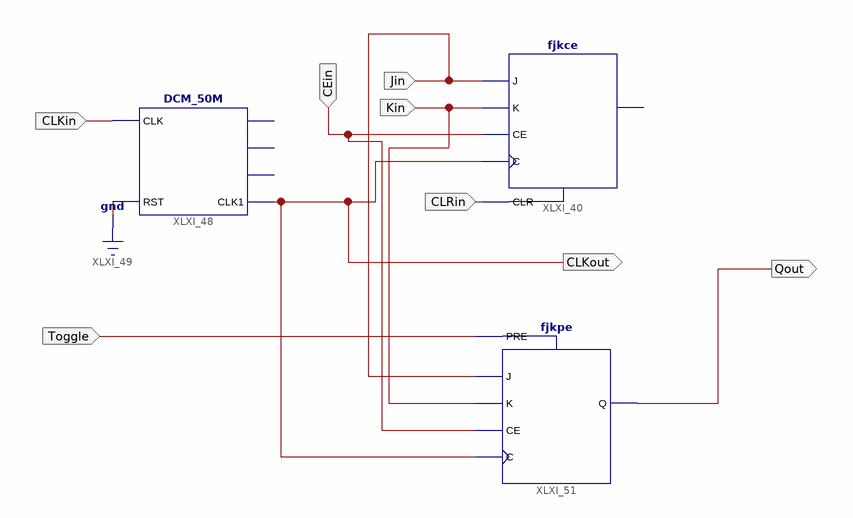
[diagram p0: schematic sheet 1]
// Xilinx ISE schematic lab7_experiment9.sch (spartan3e) as structural Verilog: 3 symbols, 8 ports
module lab7_experiment9 (
  input  Jin,
  input  Kin,
  input  CEin,
  input  CLRin,
  input  CLKin,
  input  Toggle,
  output CLKout,
  output Qout
);

  fjkce XLXI_40 (.C(CLKout), .CE(CEin), .CLR(CLRin), .J(Jin), .K(Kin));  // open: Q
  DCM_50M XLXI_48 (.CLK(CLKin), .RST(1'b0), .CLK1(CLKout));  // open: CLK1M, CLK10k, CLK1k
  fjkpe XLXI_51 (.C(CLKout), .CE(CEin), .J(Jin), .K(Kin), .PRE(Toggle), .Q(Qout));
endmodule
